# Altium schematic sheet RECTIFIER & PFC.SchDoc
size A3; CheckedBy: Alain.Zhu; CompanyName: TYMPHANY; DrawnBy: Yetta.He; Organization: PABU-BL3; Address1: 11F,block A, CEC building,; Address2: No.2070 Shennan Zhong road,; Address3: Huaqiang North, Futian District,; Address4: Shenzhen,  Guang Dong, P.R.C 518000; DocumentNumber: 2; Revision: 1.0.0; SheetNumber: 2; SheetTotal: 8; Size: A3; PCB By: Yetta.He; Status: DP1.1
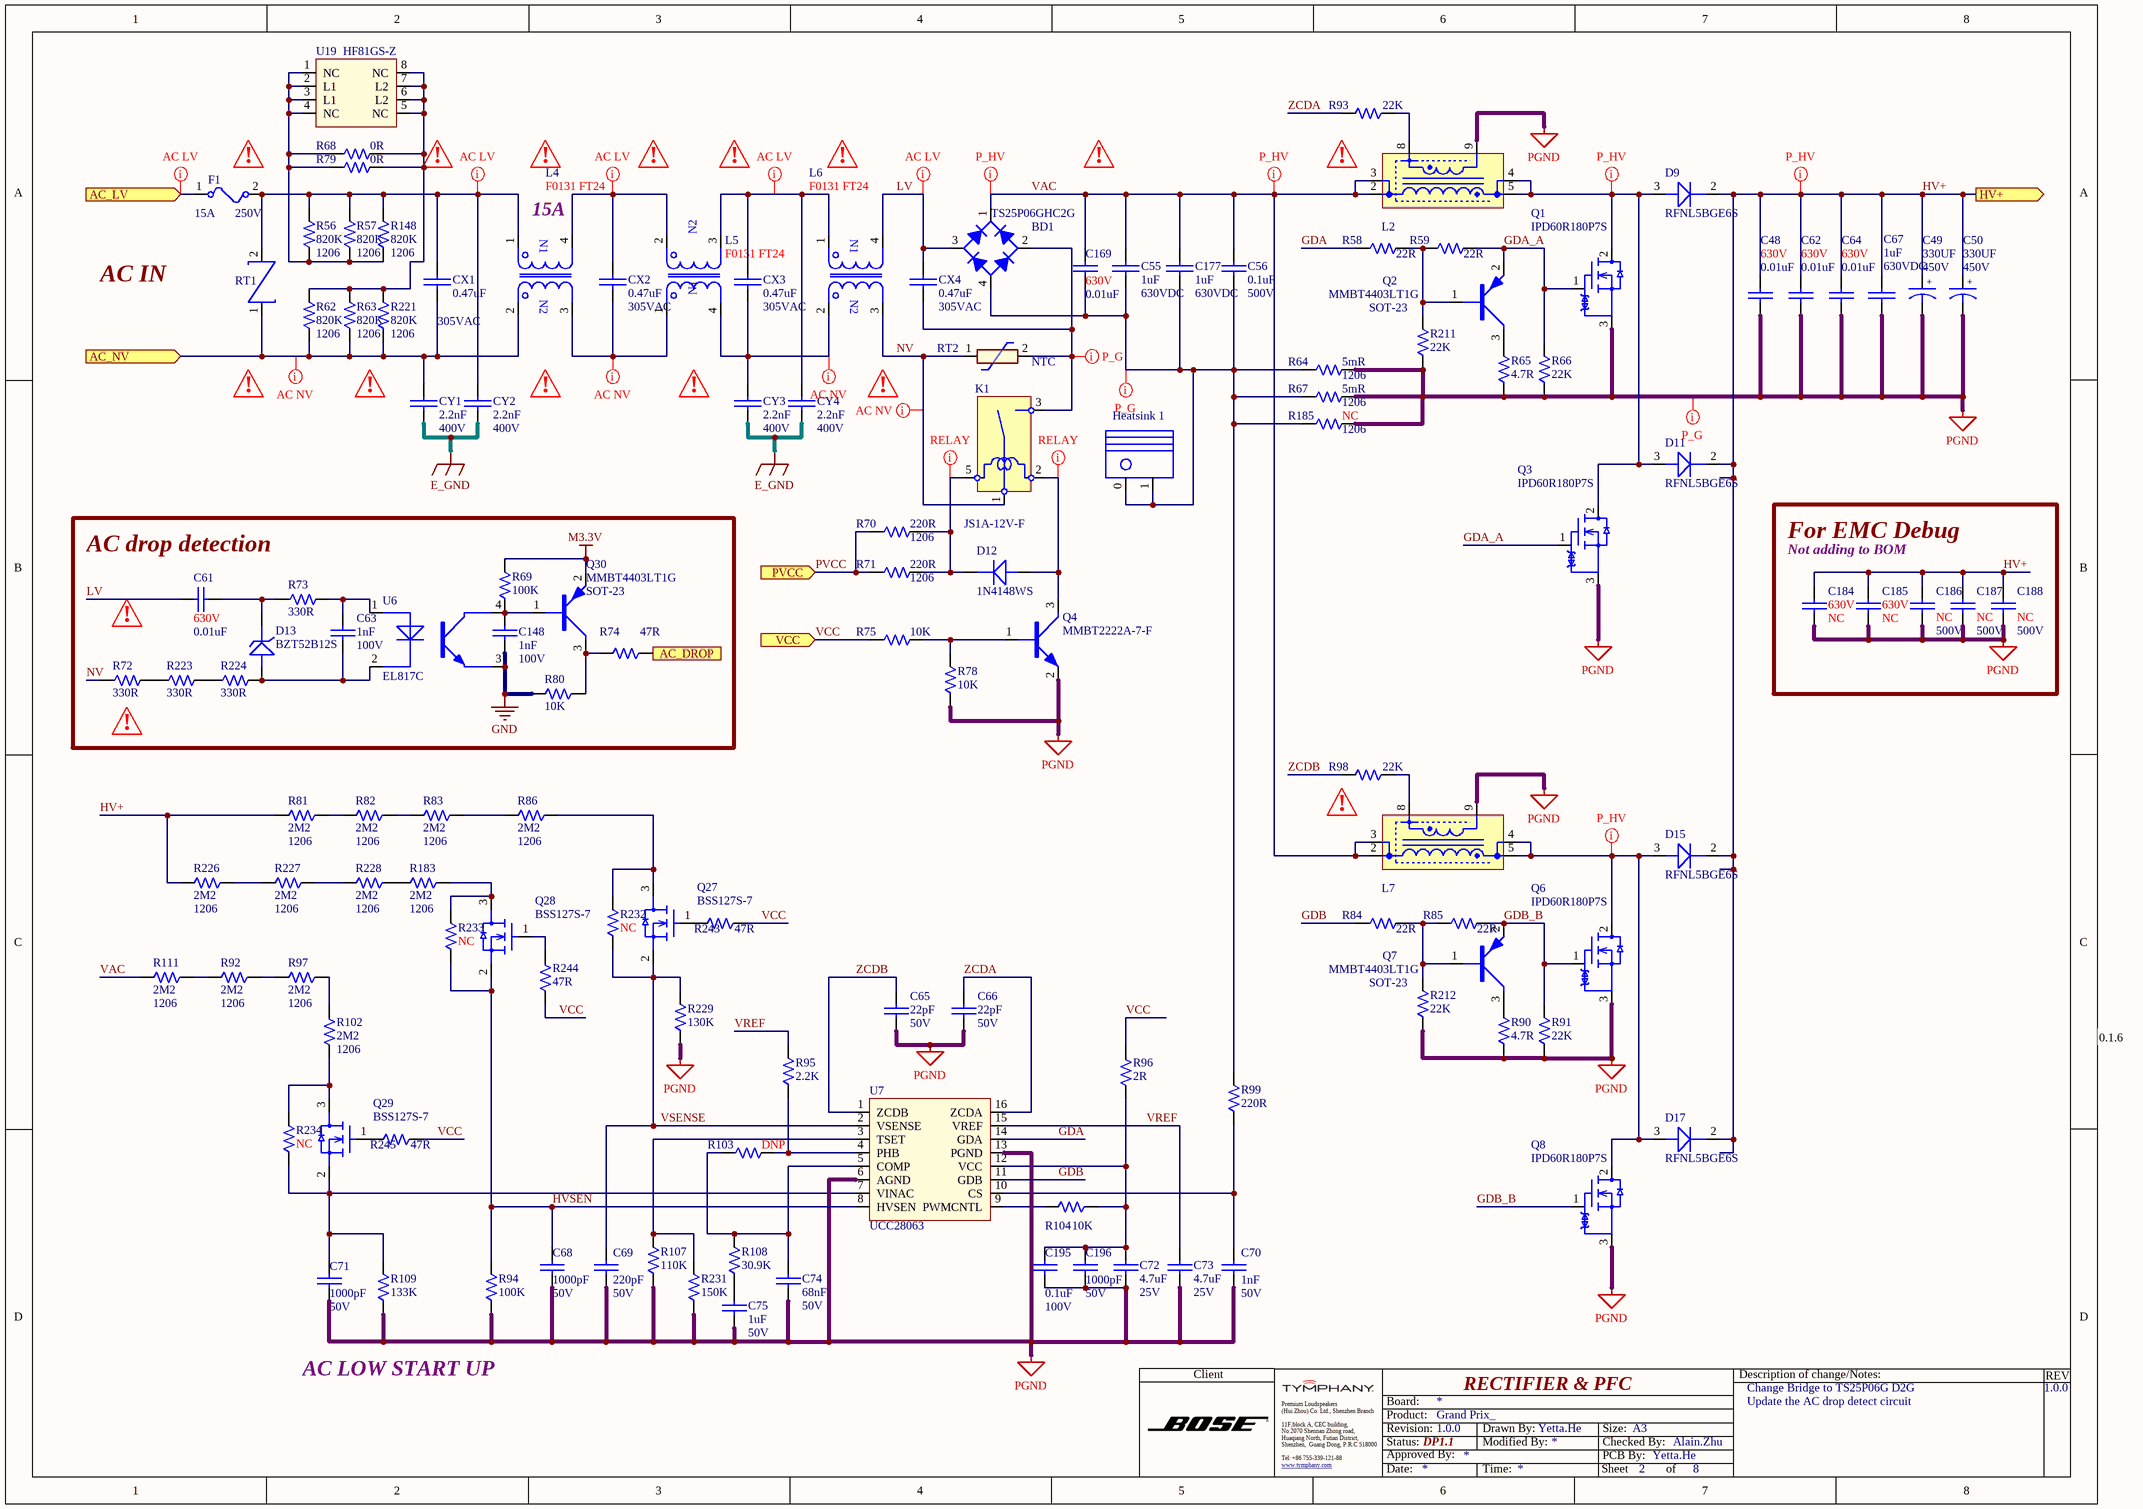
[diagram p0: RECTIFIER & PFC.SchDoc]

## Parts
(Parts that share a designator on the sheet are numbered #1, #2 ... from top to bottom, then left to right.)
*?#1  Important Sign  (value not drawn)  (graphical)
*?#2  Important Sign  (value not drawn)  (graphical)
*?#3  Important Sign  (value not drawn)  (graphical)
*?#4  Important Sign  (value not drawn)  (graphical)
*?#5  Important Sign  (value not drawn)  (graphical)
*?#6  Important Sign  (value not drawn)  (graphical)
*?#7  Important Sign  (value not drawn)  (graphical)
*?#8  Important Sign  (value not drawn)  (graphical)
*?#9  Important Sign  (value not drawn)  (graphical)
*?#10  Important Sign  (value not drawn)  (graphical)
*?#11  Important Sign  (value not drawn)  (graphical)
*?#12  Important Sign  (value not drawn)  (graphical)
*?#13  Important Sign  (value not drawn)  (graphical)
*?#14  Important Sign  (value not drawn)  (graphical)
*?#15  Important Sign  (value not drawn)  (graphical)
*?#16  Important Sign  (value not drawn)  (graphical)
BD1  BRIDGE TS25P06GHC2G  [TS25P06GHC2G]  (value not drawn)
C48  value 0.01uF  Voltage: 630V  [CAPC0805-RW]  (hidden comment: CAP X7R .01UF 630V +-10% 0805 WALSIN L)
C49  value 330UF  Voltage: 450V  [CAP_Radial_SNAPIN_D30L35P10]  (hidden comment: T5523314D3030)
C50  value 330UF  Voltage: 450V  [CAP_Radial_SNAPIN_D30L35P10]  (hidden comment: T5523314D3030)
C55  value 1uF  Voltage: 630VDC  [CAP_NP_T11L18H18.5P15]  (hidden comment: T564105317010)
C56  value 0.1uF  Voltage: 500V  [CAPC3225(1210)-RW]  (hidden comment: T542051047906)
C61  value 0.01uF  Voltage: 630V  [CAPC0805-RW]  (hidden comment: CAP X7R .01UF 630V +-10% 0805 WALSIN L)
C62  value 0.01uF  Voltage: 630V  [CAPC0805-RW]  (hidden comment: CAP X7R .01UF 630V +-10% 0805 WALSIN L)
C63  value 1nF  Voltage: 100V  [CAPC0603-RW]  (hidden comment: PXL4564A2-1020)
C64  value 0.01uF  Voltage: 630V  [CAPC0805-RW]  (hidden comment: CAP X7R .01UF 630V +-10% 0805 WALSIN L)
C65  value 22pF  Voltage: 50V  [CAPC0603-RW]  (hidden comment: PXL410370-2200)
C66  value 22pF  Voltage: 50V  [CAPC0603-RW]  (hidden comment: PXL410370-2200)
C67  value 1uF  Voltage: 630VDC  [CAP_NP_T11L18H18.5P15]  (hidden comment: T564105317010)
C68  value 1000pF  Voltage: 50V  [CAPC0603-RW]  (hidden comment: PXL410370-1020)
C69  value 220pF  Voltage: 50V  [CAPC0603-RW]  (hidden comment: T541022216505)
C70  value 1nF  Voltage: 50V  [CAPC0603-RW]  (hidden comment: PXL410370-1020)
C71  value 1000pF  Voltage: 50V  [CAPC0603-RW]  (hidden comment: PXL410370-1020)
C72  value 4.7uF  Voltage: 25V  [CAPC0603-RW]  (hidden comment: T542024757408)
C73  value 4.7uF  Voltage: 25V  [CAPC0603-RW]  (hidden comment: T542024757408)
C74  value 68nF  Voltage: 50V  [CAPC0603-RW]  (hidden comment: PXL456470-6830)
C75  value 1uF  Voltage: 50V  [CAPC0603-RW]  (hidden comment: T542021057508)
C148  value 1nF  Voltage: 100V  [CAPC0603-RW]  (hidden comment: PXL4564A2-1020)
C169  value 0.01uF  Voltage: 630V  [CAPC0805-RW]  (hidden comment: CAP X7R .01UF 630V +-10% 0805 WALSIN L)
C177  value 1uF  Voltage: 630VDC  [CAP_NP_T11L18H18.5P15]  (hidden comment: T564105317010)
C184  value NC  Voltage: 630V  [CAPC0805-RW]  (hidden comment: CAP0805 NC)
C185  value NC  Voltage: 630V  [CAPC0805-RW]  (hidden comment: CAP0805 NC)
C186  value NC  Voltage: 500V  [CAPC3225(1210)-RW]  (hidden comment: T542051047906)
C187  value NC  Voltage: 500V  [CAPC3225(1210)-RW]  (hidden comment: T542051047906)
C188  value NC  Voltage: 500V  [CAPC3225(1210)-RW]  (hidden comment: T542051047906)
C195  value 0.1uF  Voltage: 100V  [CAPC0603-RW]  (hidden comment: T542021047605)
C196  value 1000pF  Voltage: 50V  [CAPC0603-RW]  (hidden comment: PXL410370-1020)
CX1  value 0.47uF  Voltage: 305VAC  [CAP_NP_RADIAL_T9.0L18H17.5P15]  (hidden comment: PVX2395Z1-4740)
CX2  value 0.47uF  Voltage: 305VAC  [CAP_NP_RADIAL_T9.0L18H17.5P15]  (hidden comment: PVX2395Z1-4740)
CX3  value 0.47uF  Voltage: 305VAC  [CAP_NP_RADIAL_T9.0L18H17.5P15]  (hidden comment: PVX2395Z1-4740)
CX4  value 0.47uF  Voltage: 305VAC  [CAP_NP_RADIAL_T9.0L18H17.5P15]  (hidden comment: PVX2395Z1-4740)
CY1  value 2.2nF  Voltage: 400V  [CAP_NP_DISC_T6.0D9.0LH13P10]  (hidden comment: T564222414040)
CY2  value 2.2nF  Voltage: 400V  [CAP_NP_DISC_T6.0D9.0LH13P10]  (hidden comment: T564222414040)
CY3  value 2.2nF  Voltage: 400V  [CAP_NP_DISC_T6.0D9.0LH13P10]  (hidden comment: T564222414040)
CY4  value 2.2nF  Voltage: 400V  [CAP_NP_DISC_T6.0D9.0LH13P10]  (hidden comment: T564222414040)
D9  MFG Part: RFNL5BGE6S  [DPAK-3]  (hidden comment: T570000990811)
D11  MFG Part: RFNL5BGE6S  [DPAK-3]  (hidden comment: T570000990811)
D12  RCD114148-0020  [SOD-323]  (value not drawn)
D13  MFG Part: BZT52B12S  [SOD-323]  (hidden comment: T573004460941)
D15  MFG Part: RFNL5BGE6S  [DPAK-3]  (hidden comment: T570000990811)
D17  MFG Part: RFNL5BGE6S  [DPAK-3]  (hidden comment: T570000990811)
F1  Current: 15A  Voltage: 250V  [FUSE-5T-D5X20L-H]  (hidden comment: FUSE-15A250V-D5X20L)
Heatsink_1  Bridge HeatSink  [Bridge HeatSink]  (value not drawn)
K1  MFG Part: JS1A-12V-F  [RELAY JS1A-12V-F]  (hidden comment: T690400000900)
L2  IND PQ3230 HTS-PQ32S  [PQ3230 HTS-PQ32S]  (value not drawn)
L4  F0131 FT24  [F0131 FT24]
L5  F0131 FT24  [F0131 FT24]
L6  F0131 FT24  [F0131 FT24]
L7  IND PQ3230 HTS-PQ32S  [PQ3230 HTS-PQ32S]  (value not drawn)
Q1  IPD60R180P7S  [DPAK-3]
Q2  Package: SOT-23  [SOT23-132-RW]  (hidden comment: T582003100440)
Q3  IPD60R180P7S  [DPAK-3]
Q4  T581004040438  [SOT23-132-RW]  (value not drawn)
Q6  IPD60R180P7S  [DPAK-3]
Q7  Package: SOT-23  [SOT23-132-RW]  (hidden comment: T582003100440)
Q8  IPD60R180P7S  [DPAK-3]
Q27  MFG Part: BSS127S-7  [SOT23-132-RW]  (hidden comment: T586003760438)
Q28  MFG Part: BSS127S-7  [SOT23-132-RW]  (hidden comment: T586003760438)
Q29  MFG Part: BSS127S-7  [SOT23-132-RW]  (hidden comment: T586003760438)
Q30  Package: SOT-23  [SOT23-132-RW]  (hidden comment: T582003100440)
R56  value 820K  PACKAGE: 1206  [1206-RW]  (hidden comment: QCF041010-8203)
R57  value 820K  PACKAGE: 1206  [1206-RW]  (hidden comment: QCF041010-8203)
R58  value 22R  [0603-RW]  (hidden comment: QCF011030-2209)
R59  value 22R  [0603-RW]  (hidden comment: QCF011030-2209)
R62  value 820K  PACKAGE: 1206  [1206-RW]  (hidden comment: QCF041010-8203)
R63  value 820K  PACKAGE: 1206  [1206-RW]  (hidden comment: QCF041010-8203)
R64  value 5mR  PACKAGE: 1206  [1206-RW]  (hidden comment: QCF041010-5005)
R65  value 4.7R  [0805-RW]  (hidden comment: QCF081020-4708)
R66  value 22K  [0603-RW]  (hidden comment: QCF011030-2202)
R67  value 5mR  PACKAGE: 1206  [1206-RW]  (hidden comment: QCF041010-5005)
R68  value 0R  [0603-RW]  (hidden comment: T502000002009)
R69  value 100K  [0603-RW]  (hidden comment: QCF011030-1003)
R70  value 220R  PACKAGE: 1206  [1206-RW]  (hidden comment: QCF041011-2200)
R71  value 220R  PACKAGE: 1206  [1206-RW]  (hidden comment: QCF041011-2200)
R72  value 330R  [0805-RW]  (hidden comment: QCF081020-3300)
R73  value 330R  [0805-RW]  (hidden comment: QCF081020-3300)
R74  value 47R  [0603-RW]  (hidden comment: QCF011030-4709)
R75  value 10K  [0603-RW]  (hidden comment: QCF011030-1002)
R78  value 10K  [0603-RW]  (hidden comment: QCF011030-1002)
R79  value 0R  [0603-RW]  (hidden comment: T502000002009)
R80  value 10K  [0603-RW]  (hidden comment: QCF011030-1002)
R81  value 2M2  PACKAGE: 1206  [1206-RW]  (hidden comment: T502220404399)
R82  value 2M2  PACKAGE: 1206  [1206-RW]  (hidden comment: T502220404399)
R83  value 2M2  PACKAGE: 1206  [1206-RW]  (hidden comment: T502220404399)
R84  value 22R  [0603-RW]  (hidden comment: QCF011030-2209)
R85  value 22R  [0603-RW]  (hidden comment: QCF011030-2209)
R86  value 2M2  PACKAGE: 1206  [1206-RW]  (hidden comment: T502220404399)
R90  value 4.7R  [0805-RW]  (hidden comment: QCF081020-4708)
R91  value 22K  [0603-RW]  (hidden comment: QCF011030-2202)
R92  value 2M2  PACKAGE: 1206  [1206-RW]  (hidden comment: T502220404399)
R93  value 22K  [0603-RW]  (hidden comment: QCF011030-2202)
R94  value 100K  [0603-RW]  (hidden comment: QCF011030-1003)
R95  value 2.2K  [0603-RW]  (hidden comment: QCF011030-2201)
R96  value 2R  [0805-RW]  (hidden comment: QCF081020-2008)
R97  value 2M2  PACKAGE: 1206  [1206-RW]  (hidden comment: T502220404399)
R98  value 22K  [0603-RW]  (hidden comment: QCF011030-2202)
R99  value 220R  [1206-RW]  (hidden comment: QCF041011-2200)
R102  value 2M2  PACKAGE: 1206  [1206-RW]  (hidden comment: T502220404399)
R103  value DNP  [0603-RW]  (hidden comment: RES0603 NC)
R104  value 10K  [0603-RW]  (hidden comment: QCF011030-1002)
R107  value 110K  [0603-RW]  (hidden comment: QCF011030-1103)
R108  value 30.9K  [0603-RW]  (hidden comment: QCF011030-3092)
R109  value 133K  [0603-RW]  (hidden comment: QCF011030-1333)
R111  value 2M2  PACKAGE: 1206  [1206-RW]  (hidden comment: T502220404399)
R148  value 820K  PACKAGE: 1206  [1206-RW]  (hidden comment: QCF041010-8203)
R183  value 2M2  PACKAGE: 1206  [1206-RW]  (hidden comment: T502220404399)
R185  value NC  PACKAGE: 1206  [1206-RW]  (hidden comment: QCF041010-5005)
R211  value 22K  [0603-RW]  (hidden comment: QCF011030-2202)
R212  value 22K  [0603-RW]  (hidden comment: QCF011030-2202)
R221  value 820K  PACKAGE: 1206  [1206-RW]  (hidden comment: QCF041010-8203)
R223  value 330R  [0805-RW]  (hidden comment: QCF081020-3300)
R224  value 330R  [0805-RW]  (hidden comment: QCF081020-3300)
R226  value 2M2  PACKAGE: 1206  [1206-RW]  (hidden comment: T502220404399)
R227  value 2M2  PACKAGE: 1206  [1206-RW]  (hidden comment: T502220404399)
R228  value 2M2  PACKAGE: 1206  [1206-RW]  (hidden comment: T502220404399)
R229  value 130K  [0603-RW]  (hidden comment: QCF011030-1303)
R231  value 150K  [0603-RW]  (hidden comment: QCF011030-1503)
R232  value NC  [0603-RW]  (hidden comment: RES0603 NC)
R233  value NC  [0603-RW]  (hidden comment: RES0603 NC)
R234  value NC  [0603-RW]  (hidden comment: RES0603 NC)
R243  value 47R  [0603-RW]  (hidden comment: QCF011030-4709)
R244  value 47R  [0603-RW]  (hidden comment: QCF011030-4709)
R245  value 47R  [0603-RW]  (hidden comment: QCF011030-4709)
RT1  RHU722200-4001  [VARISTOR B72214S0301K101]  (value not drawn)
RT2  TYPE: NTC  [NTC_T7D12H28 PH=7.5mm]  (hidden comment: T710600037900)
U6  MFG Part: EL817C  [EL817-S1]  (hidden comment: RCI000817-0001)
U7  MFG Part: UCC28063  [SO16]  (hidden comment: RCI028063-0001)
U19  HF81GS-Z  [SO8]

## Blocks framed on the sheet
AC drop detection: *?#14 *?#15 C61 C63 C148 D13 Q30 R69 R72-R74 R80 R223 R224 U6
For EMC Debug: C184-C188

## Ports
AC_DROP, AC_LV (in), AC_NV (in), HV+ (out), PVCC (in), VCC (in)

## Nets
E_GND: CY1.2 CY2.2 CY3.2 CY4.2
GND: C148.1 R80.2 U6.3(C)
M3.3V: Q30.2(E) R69.2
PGND: C48.2 C49.2 C50.2 C62.2 C64.2 C65.2 C66.2 C67.2 C68.2 C69.2 C70.2 C71.2 C72.2 C73.2 C74.2 C75.2 C184.2 C185.2 C186.2 C187.2 C188.2 C195.2 C196.2 L2.9 L7.9 Q1.3(D) Q3.3(D) Q4.2(E) Q6.3(D) Q8.3(D) R64.2 R65.1 R66.1 R67.2 R78.1 R90.1 R91.1 R94.1 R107.1 R109.1 R185.2 R211.1 R212.1 R229.1 R231.1 U7.6(AGND) U7.13(PGND)
AC_DROP: R74.1 ; port AC_DROP
AC_LV: F1.1 ; port AC_LV
AC_NV: CX1.2 CY1.1 L4.2 R62.1 R63.1 R221.1 RT1.1 ; port AC_NV
GDA: R58.1 U7.14(GDA)
GDA_A: Q1.1(G) Q2.2(E) Q3.1(G) R59.2 R66.2
GDB: R84.1 U7.11(GDB)
GDB_B: Q6.1(G) Q7.2(E) Q8.1(G) R85.2 R91.2
HV+: C48.1 C49.1 C50.1 C62.1 C64.1 C67.1 C184.1 C185.1 C186.1 C187.1 C188.1 D9.2(K) D11.2(K) D15.2(K) D17.2(K) R81.2 R226.2 ; port HV+
HVSEN: C68.1 Q28.2(G) R94.2 R233.1 U7.8(HVSEN)
LV: BD1.3(C) C61.1 CX4.1 L6.4
NV: K1.1 L6.3 R72.1 RT2.1
PVCC: R70.1 R71.1 ; port PVCC
VAC: BD1.1(K) C55.1 C56.1 C169.1 C177.1 L2.2 L2.3 L7.2 L7.3 R111.2
VCC: R75.1 R96.1 R243.1 R244.2 R245.1 ; port VCC
VREF: C73.1 R95.2 U7.15(VREF)
VSENSE: C69.1 Q27.2(G) R229.2 R232.1 U7.2(VSENSE)
ZCDA: C66.1 R93.2 U7.16(ZCDA)
ZCDB: C65.1 R98.2 U7.1(ZCDB)
NetBD1_2: BD1.2(C) CX4.2 K1.3 RT2.2
NetBD1_4: BD1.4(A) C55.2 C56.2 C169.2 C177.2 Heatsink_1.0(Plate) Heatsink_1.1(Plate) R64.1 R67.1 R99.2 R185.1
NetC61_2: C61.2 D13.2(K) R73.1
NetC63_1: C63.1 D13.1(A) R224.2 U6.2(E)
NetC63_2: C63.2 R73.2 U6.1(B)
NetC70_1: C70.1 R99.1 U7.10(CS)
NetC71_1: C71.1 Q29.2(G) R109.2 R234.1 U7.7(VINAC)
NetC72_1: C72.1 C195.1 C196.1 R96.2 R104.1 U7.12(VCC)
NetC74_1: C74.1 R103.1 R108.2 U7.5(COMP)
NetC75_1: C75.1 R108.1
NetC148_2: C148.2 Q30.1(B) R69.1 U6.4(C)
NetCX1_1: CX1.1 CY2.1 F1.2 L4.1 R56.2 R57.2 R148.2 RT1.2
NetCX2_1: CX2.1 L4.4 L5.2
NetCX2_2: CX2.2 L4.3 L5.1
NetCX3_1: CX3.1 CY4.1 L5.3 L6.1
NetCX3_2: CX3.2 CY3.1 L5.4 L6.2
NetD9_3: D9.3(A) D11.3(A) L2.4 L2.5 Q1.2(S) Q3.2(S)
NetD12_1: D12.1(A) K1.2 Q4.3(C)
NetD12_2: D12.2(K) K1.5 R70.2 R71.2
NetD15_3: D15.3(A) D17.3(A) L7.4 L7.5 Q6.2(S) Q8.2(S)
NetL2_8: L2.8 R93.1
NetL7_8: L7.8 R98.1
NetQ2_1: Q2.1(B) R58.2 R59.1 R211.2
NetQ2_3: Q2.3(C) R65.2
NetQ4_1: Q4.1(B) R75.2 R78.2
NetQ7_1: Q7.1(B) R84.2 R85.1 R212.2
NetQ7_3: Q7.3(C) R90.2
NetQ27_1: Q27.1(S) R243.2
NetQ27_3: Q27.3(D) R86.1 R232.2
NetQ28_1: Q28.1(S) R244.1
NetQ28_3: Q28.3(D) R183.1 R233.2
NetQ29_1: Q29.1(S) R245.2
NetQ29_3: Q29.3(D) R102.2 R234.2
NetQ30_3: Q30.3(C) R74.2 R80.1
NetR56_1: R56.1 R57.1 R68.1 R79.1 R148.1 U19.1(NC) U19.2(L1) U19.3(L1) U19.4(NC)
NetR62_2: R62.2 R63.2 R68.2 R79.2 R221.2 U19.5(NC) U19.6(L2) U19.7(L2) U19.8(NC)
NetR72_2: R72.2 R223.1
NetR81_1: R81.1 R82.2
NetR82_1: R82.1 R83.2
NetR83_1: R83.1 R86.2
NetR92_1: R92.1 R97.2
NetR92_2: R92.2 R111.1
NetR95_1: R95.1 R103.2 U7.4(PHB)
NetR97_1: R97.1 R102.1
NetR104_2: R104.2 U7.9(PWMCNTL)
NetR107_2: R107.2 R231.2 U7.3(TSET)
NetR183_2: R183.2 R228.1
NetR223_2: R223.2 R224.1
NetR226_1: R226.1 R227.2
NetR227_1: R227.1 R228.2

## Layout directives
net class AC LV: AC_LV, LV, NetCX1_1, NetCX2_1, NetCX3_1
net class AC NV: AC_NV, NetCX2_2, NetCX3_2, NV
net class P_HV: HV+, NetD9_3, NetD15_3, VAC
net class P_G: NetBD1_2, NetBD1_4, PGND
net class RELAY: NetD12_1, NetD12_2

## Notes on the sheet
- (near L4) 15A
- AC IN
- Not adding to BOM
- 0.1.6
- AC LOW START UP
- RECTIFIER & PFC
- Change Bridge to TS25P06G D2G
- Update the AC drop detect circuit
- Client
- Description of change/Notes:
- REV
- Premium Loudspeakers
- (Hui Zhou) Co. Ltd., Shenzhen Branch
- Tel: +86 755-339-121-88
- Board:
- Status:
- Revision:
- Product:
- Approved By:
- Grand Prix_
- Drawn By:
- Modified By:
- Checked By:
- PCB By:
- Size:
- www.tymphany.com <http://www.tymphany.com>
- Date:
- Time:
- Sheet
- of
- (in symbol CAP E 330UF 450V +-20%_D30L35P10_NIPPON-LHS) +
- (in symbol F0131 FT24) N1; N2
- (in symbol Important Sign) !

## Library data of the parts
BD1 = BRIDGE TS25P06GHC2G: MFG: TSC; SAP: T571002960104; Voltage: 800V; Current: 25A; DIP&SMD: DIP; CREATE_NAME: Cherry; Vendor Name: *; Vendor Code: *; Type: BRIDGE; Customer Specific: N/A; CREATE_TIME: 2019-04-02; Package: TS-6P; MFG Part: TS25P06GHC2G
C48 C61 C62 C64 C169 = CAP0805 NC: NC; SAP: T542031037C08; Type: Capacitor; CREATE_NAME: Tom; DIP&SMD: SMD; PACKAGE: CAPC0805; Vendor Code: *; Vendor Name: *; MFG: Walsin; MFG Part: *; Tolerance: *; CREATE_NAME: 18-Mar-2016; Customer Specific: N/A
C49 C50 = CAP E 330UF 450V +-20%_D30L35P10_NIPPON-LHS: E 330UF 450V +-20% 30X35M ELHS451VS K; MFG Part: ELHS451VSN331MR35S; MFG: NIPPON; Tolerance: 20%; Type: Capacitor; DIP&SMD: DIP; SAP: T5523314D3030; PACKAGE: 330uF/450V; Vendor Name: *; Vendor Code: *; Other: *; Customer Specific: N/A; CREAT NAME: 2019-04-09
C55 C67 C177 = CAP E METAL 1uF 630VDC 10% - TDK_MKP_B32672P: PLS-DIP 1UF 630V +-10% W B32672P6 K; MFG Part: B32672P6105K; MFG: Epcos(TDK); Tolerance: 10%; Type: Capacitor; CREATE_NAME: Nathan; DIP&SMD: DIP; SAP: T564105317010; PACKAGE: 1uF/630VDC; Vendor Name: *; Vendor Code: *; CREATE_TIME: 12-Nov-2018; Customer Specific: N/A
C56 C186-C188 = CAP1210 0.1uF 500V 10%_X7R_KEMET: CAP X7R .10UF 500V +-10% 1210 KEMET L; Tolerance: 10%; Type: Capacitor; CREATE_NAME: Nathan; DIP&SMD: SMD; SAP: T542051047906; PACKAGE: CAPC1210; Vendor Code: *; Vendor Name: *; MFG: KEMET; MFG Part: *; Other: X7R; CREATE_TIME: 24-Oct-2016; Customer Specific: N/A
C63 C148 = CAP0603 1nF 100V 10% - PXL4564A2-1020: CHIP CAP 1nF 100V 10%; SAP: T542021027608; Vendor Code: 10010262; Vendor Name: 东莞市晴远电子有限公司; Type: Capacitor; DIP&SMD: SMD; PACKAGE: CAPC0603; MFG: *; MFG Part: *; Other: *; Tolerance: 10%; Customer Specific: N/A
C65 C66 = CAP0603 22pF 50V 5%: GP CHIP CAP 22pF 50V 5% 0603 TYPE NPO; SAP: T541022205508; Vendor Code: 10010262; Vendor Name: ¶«Ý¸ÊÐÇçÔ¶µç×ÓÓÐÏÞ¹«Ë¾; Type: Capacitor; PACKAGE: CAPC0603; MFG: *; MFG Part: *; Other: NPO; Tolerance: 5%
C68 C71 C196 = CAP0603 1000pF 50V 5% - PXL410370-1020: CHIP CAP 1000pF 50V 5% 0603 TYPE NPO; SAP: T541021026508; Vendor Code: 10010262; Vendor Name: 东莞市晴远电子有限公司; Type: Capacitor; DIP&SMD: SMD; PACKAGE: CAPC0603; MFG: *; MFG Part: *; Other: NPO; Tolerance: 5%; Customer Specific: N/A
C69 = CAP0603 220pF 50V 5%_NPO_MURATA: CAP NPO 220PF 50V +-5% 0603 MURATA L; Tolerance: 5%; Type: Capacitor; CREATE_NAME: Nathan; DIP&SMD: SMD; SAP: T541022216505; PACKAGE: CAPC0603; Vendor Name: *; MFG: MURATA; MFG Part: *; Other: NPO; CREATE_TIME: 02-Aug-2016; Customer Specific: N/A
C70 = CAP0603 1000pF 50V 5% - PXL410370-1020: CHIP CAP 1000pF 50V 5% 0603 TYPE NPO; SAP: T541021026508; Vendor Code: 10010262; Vendor Name: ¶«Ý¸ÊÐÇçÔ¶µç×ÓÓÐÏÞ¹«Ë¾; Type: Capacitor; PACKAGE: CAPC0603; MFG: *; MFG Part: *; Other: NPO; Tolerance: 5%
C72 C73 = CAP0603 4.7uF 25V 10%_X7R_WALSIN: CAP X7R 4.7UF 25V +-10% 0603 WALSIN L; Tolerance: 10%; Type: Capacitor; CREATE_NAME: Nathan; DIP&SMD: SMD; SAP: T542024757408; PACKAGE: CAPC0603; Vendor Name: *; MFG: WALSIN; MFG Part: *; Other: X7R; CREATE_TIME: 13-July-2016; Customer Specific: N/A
C74 = CAP0603 68nF 50V 10% - PXL456470-6830: CHIP CAP 68nF 50V 10% 0603  X7R; SAP: T542026837508; Vendor Code: 10010262; Vendor Name: 东莞市晴远电子有限公司; Type: Capacitor; DIP&SMD: SMD; PACKAGE: CAPC0603; MFG: *; MFG Part: *; Other: X7R; Tolerance: 10%; Customer Specific: N/A
C75 = CAP0603 1uF 50V 10%_X7R_WALSIN: CAP X7R 1.0UF 50V +-10% 0603 WALSIN L; Tolerance: 10%; Type: Capacitor; CREATE_NAME: Nathan; DIP&SMD: SMD; SAP: T542021057508; PACKAGE: CAPC0603; Vendor Name: *; MFG: WALSIN; MFG Part: *; Other: X7R; CREATE_TIME: 13-July-2016; Customer Specific: N/A
C184 C185 = CAP0805 NC: NC; MFG: Walsin; Type: Capacitor; CREATE_NAME: Tom; DIP&SMD: SMD; SAP: *; PACKAGE: CAPC0805; Vendor Code: *; Vendor Name: *; MFG Part: *; Tolerance: *; CREATE_NAME: 18-Mar-2016; Customer Specific: N/A
C195 = CAP0603 0.1uF 100V 10%_X7R_MURATA: CAP X7R .10UF 100V +-10% 0603 MURATA L; Tolerance: 10%; Type: Capacitor; CREATE_NAME: Nathan; DIP&SMD: SMD; SAP: T542021047605; PACKAGE: CAPC0603; MFG: MURATA; MFG Part: *; Other: X7R; CREATE_TIME: 02-Aug-2016; Customer Specific: N/A; Vendor Name: *
CX1-CX4 = CAP SAFETY 0.47uF 305V 20%: COND SAFETY P=15MM 20% 305V X2 0.47uF; MFG Part: B32922C3474K000; SAP: T564474431010; MFG: EPCOS; Tolerance: 10%; CREATE_NAME: Nathan; DIP&SMD: DIP; Vendor Name: *; Vendor Code: *; Other: X2; Type: Capacitor; CREATE_TIME: 05-FEB-2015; PACKAGE: 0.47uF/305VAC; Customer Specific: N/A
CY1-CY4 = CAP SAFETY 2.2nF 400V 20% Y1 - TDK_CD45: PLS-DIP 2200PF 400V +-20% D CD45-E2G K; MFG Part: CD45-E2GA222M-NKA; MFG: TDK; Tolerance: 20%; CREATE_NAME: Nathan; DIP&SMD: DIP; SAP: T564222414040; PACKAGE: 2.2nF\400V; Vendor Name: *; Vendor Code: *; Other: *; CREATE_TIME: 12-Nov-2018; Type: Capacitor; Customer Specific: N/A
D9 D11 D15 D17 = DIO RFNL5BGE6S: SP 600V 5A RFNL5BGE6S SMD ROHM K; Type: DIODE; CREATE_NAME: Nathan; MFG: ROHM; SAP: T570000990811; Vendor Name: *; Vendor Code: *; Voltage: 600V; Current: 5A; CREATE_TIME: 19-Mar-2019; DIP&SMD: SMD; Customer Specific: N/A; Package: TO-252
D12 = 1N4148WS: DIODE SW 1N4148 VF=0.7V SOD-323; MFG: TW SEMICONDUCTOR; SAP: T572005070208; Voltage: 100V; Current: 150MA; DIP&SMD: SMD; Vendor Name: *; Vendor Code: *; Type: DIODE; MFG Part: 1N4148WS; Package: SOD-323; Customer Specific: N/A
D13 = BZT52B12S_TSC: ZD 12V 200MW ±2% SMD TSC ( K; MFG: TSC (TAIWAN SEMICONDUCTOR); Type: ZENER; CREATE_NAME: Nathan; SAP: T573004460941; Vendor Code: *; Vendor Name: *; Current: *; Tolerance: 2%; Power: 200MW; VOLTAGE: 12V; Package: SOD-323F; CREATE_TIME: 15-Mar-2019; DIP&SMD: SMD; Customer Specific: N/A
F1 = FUSE-15A250V-D5X20L: Fuse 15A Littlefuse Fuse-215; MFG: Littelfuse; DIP&SMD: DIP; CREATE NAME: Nathan; SAP: *; Vendor Code: *; Vendor Name: *; MFG Part: *; Type: FUSE; CREATE TIME: 22-NOV-2018
K1 = RELAY JS1A-12V-F: RELAY 12V 250V 10A DIP JS1A-12V- K; MFG: PANASONIC; CREATE_NAME: Nathan; SAP: T690400000900; Vendor Code: *; Vendor Name: *; Type: RELAY; Voltage: 12V; Current: *; CREATE_TIME: 13-MAR-2019; DIP&SMD: DIP
L2 L7 = IND PQ3230 HTS-PQ32S: 100UH Gloria; CREATE_NAME: Yetta; Type: TRANSFORMER; DIP&SMD: DIP; CREATE_TIME: 25-April-2019; MFG: Gloria; MFG Part: HTS-PQ32S; Value: *; Vendor Code: *; Vendor Name: *
L4-L6 = F0131 FT24: MFG: 三盛; CREATE_NAME: Tom; Type: INDUCTOR; DIP&SMD: DIP; SAP: F0131 FT24; Vendor Code: *; Vendor Name: *; CREATE_TIME: 23-Aug-2016; MFG Part: F0131 FT24
Q1 Q3 Q6 Q8 = IPD60R180P7S: 600V CoolMOS Power Transistor; MFG: INFINEON; SAP: T586003650350; Type: NMOS; CREATE_NAME: Nathan; Voltage: 650V; Current: 53A; DIP&SMD: SMD; Vendor Code: *; Vendor Name: *; CREATE_TIME: 28-Sep-2018; Package: TO252-3(DPAK); Power: *; Customer Specific: N/A; MFG Part: IPD60R180P7S
Q2 Q7 Q30 = MMBT4403LT1G: PNP -40V MMBT4403LT1G SOT23 ON K; Voltage: 40V; DIP&SMD: SMD; Current: 600mA; CREATE NAME: Nathan; SAP: T582003100440; MFG: ON; Vendor Code: *; Vendor Name: *; Type: PNP; Customer Specific: N/A; MFG Part: MMBT4403LT1G; CREATE TIME: 25-Dec-2018
Q4 = MMBT2222A-7-F: NPN 40V MMBT2222A-7- SOT23 DIODES K; MFG: DIODES  (ZETEX); CREATE_NAME: Nathan; DIP&SMD: SMD; SAP: T581004040438; Vendor Code: *; Vendor Name: *; Voltage: *; Type: NPN; CREATE_TIME: 15-Mar-2019; Current: *; Customer Specific: N/A; MFG Part: MMBT2222A-7-F
Q27-Q29 = NMOS BSS127S-7: NMOS 600V BSS127S-7 SOT23 DIODES K; DIP&SMD: SMD; Current: 70mA; SAP: T586003760438; Power: *; Vendor Code: *; Vendor Name: *; MFG: DIODES; Type: *; Customer Specific: N/A; Package: *; Voltage: 600V; CREAT TIME: 2019-04-09
R56 R57 R62 R63 R148 R221 = RES1206 1/4W 1% 820K OHM: CHIP RES 820K OHM 1/4W 1% 1206; Vendor Code: 10010262; SAP: T502820304399; Vendor Name: 东莞市晴远电子有限公司; DIP&SMD: SMD; Power: 1/4W; MFG Part: *; MFG: *; TOL: 1%; Type: Resistor; Customer Specific: N/A
R58 R59 R84 R85 = RES0603 1/10W 1% 22 OHM: GP CHIP RES. 22 OHM 1/10W 1% 0603; Vendor Code: 10010262; SAP: T502220A02399; Vendor Name: 东莞市晴远电子有限公司; DIP&SMD: SMD; Power: 1/10W; MFG Part: *; MFG: *; TOL: 1%; Type: Resistor; PACKAGE: 0603; Customer Specific: N/A
R64 R67 R185 = RES1206 1/4W 1% 0.005 OHM: CHIP RES 0.005 OHM 1/4W 1% 1206; Vendor Code: 10010262; SAP: T502500E043G9; Vendor Name: 东莞市晴远电子有限公司; DIP&SMD: SMD; Power: 1/4W; MFG Part: *; MFG: *; TOL: 1%; Type: Resistor; Customer Specific: N/A
R65 R90 = RES0805 1/8W 1% 4.7 OHM: GP CHIP RES 4.7 OHM 1/8W 1% 0805; Vendor Code: 10010262; SAP: T502470B03399; Vendor Name: 东莞市晴远电子有限公司; DIP&SMD: SMD; Power: 1/8W; MFG Part: *; MFG: *; TOL: 1%; Type: Resistor; PACKAGE: 0805; Customer Specific: N/A
R66 R91 R93 R98 R211 R212 = RES0603 1/10W 1% 22K OHM: GP CHIP RES. 22K OHM 1/10W 1% 0603; Vendor Code: 10010262; SAP: T502220202399; Vendor Name: ¶«Ý¸ÊÐÇçÔ¶µç×ÓÓÐÏÞ¹«Ë¾; DIP&SMD: SMD; Power: 1/10W; MFG Part: *; MFG: *; TOL: 1%; Type: Resistor; PACKAGE: 0603; Customer Specific: N/A
R68 R79 = RES0603 1/10W 0 OHM_WALSIN: CHIP 0 OHM 0 OHM 0 OHM 0603 WALSIN L; MFG Part: WR06X000PTL; Power: 1/10W; MFG: WALSIN (華新); DIP&SMD: SMD; Vendor Code: *; SAP: T502000002009; Vendor Name: *; TOL: *; Type: Resistor; PACKAGE: 0603; Customer Specific: N/A
R69 R94 = RES0603 1/10W 1% 100K OHM: GP CHIP RES. 100K OHM 1/10W 1% 0603; Vendor Code: 10010262; SAP: T502100302399; Vendor Name: 东莞市晴远电子有限公司; DIP&SMD: SMD; Power: 1/10W; MFG Part: *; MFG: *; TOL: 1%; Type: Resistor; PACKAGE: 0603; Customer Specific: N/A
R70 R71 = RES1206 1/4W 1% 220 OHM: CHIP RES. 220 OHM 1/4W 1% 1206; Vendor Code: 10010262; SAP: T502220004399; Vendor Name: ¶«Ý¸ÊÐÇçÔ¶µç×ÓÓÐÏÞ¹«Ë¾; DIP&SMD: SMD; Power: 1/4W; MFG Part: *; MFG: *; TOL: 1%; Type: Resistor; Customer Specific: N/A
R72 R73 R223 R224 = RES0805 1/8W 1% 330 OHM: CHIP RES. 330 OHM 1/8W 1% 0805; Vendor Code: 10010262; SAP: T502330003399; Vendor Name: 东莞市晴远电子有限公司; DIP&SMD: SMD; Power: 1/8W; MFG Part: *; MFG: *; TOL: 1%; Type: Resistor; PACKAGE: 0805; Customer Specific: N/A
R74 R243-R245 = RES0603 1/10W 1% 47 OHM: GP CHIP RES. 47 OHM 1/10W 1% 0603; Vendor Code: 10010262; SAP: T502470A02399; Vendor Name: 东莞市晴远电子有限公司; DIP&SMD: SMD; Power: 1/10W; MFG Part: *; MFG: *; TOL: 1%; Type: Resistor; PACKAGE: 0603; Customer Specific: N/A
R75 R78 R80 = RES0603 1/10W 1% 10K OHM: GP CHIP RES. 10K OHM 1/10W 1% 0603; Vendor Code: 10010262; SAP: T502100202399; Vendor Name: 东莞市晴远电子有限公司; DIP&SMD: SMD; Power: 1/10W; MFG Part: *; MFG: *; TOL: 1%; Type: Resistor; PACKAGE: 0603; Customer Specific: N/A
R81-R83 R86 R92 R97 R102 R111 R183 R226-R228 = RES1206 1/4W 1% 2.2M OHM_WALSIN: CHIP 2.2M OHM 100PPM +-1% 1206 WALS K; Power: 1/4W; MFG: WALSIN (華新); TOL: 1%; CREATE_NAME: Nathan; DIP&SMD: SMD; Vendor Code: *; SAP: T502220404399; Vendor Name: *; MFG Part: *; Type: Resistor; CREATE_TIME: 13-May-2019; Customer Specific: N/A
R95 = RES0603 1/10W 1% 2.2K OHM: GP CHIP RES. 2.2K OHM 1/10W 1% 0603; Vendor Code: 10010262; SAP: T502220102399; Vendor Name: 东莞市晴远电子有限公司; DIP&SMD: SMD; MFG Part: *; MFG: *; TOL: 1%; Type: Resistor; Power: 1/10W; PACKAGE: 0603; Customer Specific: N/A
R96 = RES0805 1/8W 1% 2 OHM: CHIP RES. 2 OHM 1/8W 1% 0805; Vendor Code: 10010262; SAP: T502200B03399; Vendor Name: 东莞市晴远电子有限公司; Power: *; MFG Part: *; MFG: *; TOL: 1%; Type: Resistor; PACKAGE: 0805
R99 = RES1206 1/4W 1% 220 OHM: CHIP RES. 220 OHM 1/4W 1% 1206; Vendor Code: 10010262; SAP: T502220004399; Vendor Name: 东莞市晴远电子有限公司; DIP&SMD: SMD; Power: 1/4W; MFG Part: *; MFG: *; TOL: 1%; Type: Resistor; PACKAGE: 1206; Customer Specific: N/A
R103 R232-R234 = RES0603 NC: NC; CREATE_NAME: Tom; DIP&SMD: SMD; SAP: *; Tolerance: *; MFG Part: *; MFG: *; Vendor Code: *; Vendor Name: *; Type: Resistor; Power: *; CREATE_TIME: 18-Mar-2016; Package: 0603; Customer Specific: N/A
R104 = RES0603 1/10W 1% 10K OHM: GP CHIP RES. 10K OHM 1/10W 1% 0603; Vendor Code: 10010262; SAP: T502100202399; Vendor Name: ¶«Ý¸ÊÐÇçÔ¶µç×ÓÓÐÏÞ¹«Ë¾; Power: *; MFG Part: *; MFG: *; TOL: 1%; Type: Resistor; PACKAGE: 0603
R107 = RES0603 1/10W 1% 110K OHM: CHIP RES 110K OHM 1/10W 1% 0603; Vendor Code: 10010262; SAP: T502110302399; Vendor Name: 东莞市晴远电子有限公司; DIP&SMD: SMD; Power: 1/10W; MFG Part: *; MFG: *; TOL: 1%; Type: Resistor; PACKAGE: 0603; Customer Specific: N/A
R108 = RES0603 1/10W 1% 30.9K OHM: CHIP RES. 30.9K OHM 1/10W 1% 0603; Vendor Code: 10010262; SAP: T502309202399; Vendor Name: 东莞市晴远电子有限公司; DIP&SMD: SMD; Power: 1/10W; MFG Part: *; MFG: *; TOL: 1%; Type: Resistor; PACKAGE: 0603; Customer Specific: N/A
R109 = RES0603 1/10W 1% 133K OHM: GP CHIP RES. 133K OHM 1/10W 1% 0603; Vendor Code: 10010262; SAP: T502133302399; Vendor Name: 东莞市晴远电子有限公司; DIP&SMD: SMD; Power: 1/10W; MFG Part: *; MFG: *; TOL: 1%; Type: Resistor; PACKAGE: 0603; Customer Specific: N/A
R229 = RES0603 1/10W 1% 130K OHM: GP CHIP RES 130K OHM 1/10W 1% 0603; Vendor Code: 10010262; SAP: T502130302399; Vendor Name: 东莞市晴远电子有限公司; DIP&SMD: SMD; Power: 1/10W; MFG Part: *; MFG: *; TOL: 1%; Type: Resistor; PACKAGE: 0603; Customer Specific: N/A
R231 = RES0603 1/10W 1% 150K OHM: CHIP RES 150K OHM 1/10W 1% 0603; Vendor Code: 10010262; SAP: T502150302399; Vendor Name: 东莞市晴远电子有限公司; DIP&SMD: SMD; Power: 1/10W; MFG Part: *; MFG: *; TOL: 1%; Type: Resistor; PACKAGE: 0603; Customer Specific: N/A
RT1 = MOV B72214S0301K101: MOV 300V B72214S0301K DIP EPCOS G; SAP: T591000148300; Pmax: 0.6W; Imax (8/20us): 4500A; Vdc: 385V; CREATE_NAME: Nathan; MFG: EPCOS; Vendor Name: *; Vendor Code: *; MFG Part: B72214S0301K101; Vrms: 300V; TYPE: MOV; CREATE_TIME: 06-Feb-2015; DIP&SMD: DIP; Customer Specific: N/A
RT2 = NTC B57364S0100M000: NTC THERMISTOR 10 OHM TDK K; R(25'C): 10 ohm; Imax (0~65'C): 7.5A; CREATE_NAME: Nathan; DIP&SMD: DIP; MFG: TDK; SAP: T710600037900; Vendor Name: *; Vendor Code: *; MFG Part: B57364S0100M000; CREATE_TIME: 10-Apr-2019; Customer Specific: N/A
U6 = EL817C-S1: IC 4PIN SMT EL817C  Ever Light; SAP: T58A000491533; Vendor Code: 10020351; Vendor Name: 深圳市卅亿光电有限公司; DIP&SMD: SMD; MFG: Everlight; Type: IC; Customer Specific: N/A
U7 = UCC28063DR: IC 16P SOP-16 UCC28063; MFG: TI; SAP: T610000038104; CREATE_NAME: Nathan@Tymphany; DIP&SMD: SMD; Vendor Code: *; Vendor Name: *; Type: IC; CREATE_TIME: 24-July-2014; Customer Specific: N/A
U19 = HF81GS-Z: IC HF81GS-Z; MFG: MPS; CREATE_NAME: Nathan; DIP&SMD: SMD; SAP: *; Vendor Code: *; Vendor Name: *; Package: SOP8; CREATE_TIME: 06-May-2019; Customer Specific: N/A; MFG Part: HF81GS-Z